# Altium schematic sheet USB.SchDoc
size A
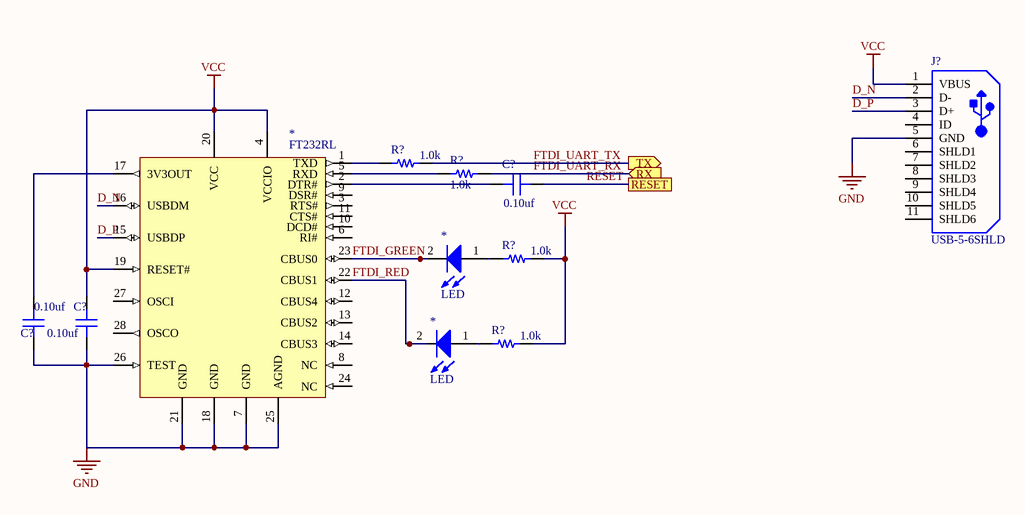
[diagram p0: USB.SchDoc]

## Parts
(Parts that share a designator on the sheet are numbered #1, #2 ... from top to bottom, then left to right.)
*#1  FT232RL  [SSOP-28]
*#2  LED  [0805_LED]
*#3  LED  [0805_LED]
C?#1  value 0.10uf  [CAP 0603/1608]  (hidden comment: Capacitor MLCC 0.10uf 25V CAP 0603/1608)
C?#2  value 0.10uf  [CAP 0603/1608]  (hidden comment: Capacitor MLCC 0.10uf 25V CAP 0603/1608)
C?#3  value 0.10uf  [CAP 0603/1608]  (hidden comment: Capacitor MLCC 0.10uf 25V CAP 0603/1608)
J?  USB-5-6SHLD  [TECO-1981568-5_V]
R?#1  value 1.0k  [RES 0805/2012]  (hidden comment: Resistor 1.0k 0805 1/4W 1%)
R?#2  value 1.0k  [RES 0805/2012]  (hidden comment: Resistor 1.0k 0805 1/4W 1%)
R?#3  value 1.0k  [RES 0805/2012]  (hidden comment: Resistor 1.0k 0805 1/4W 1%)
R?#4  value 1.0k  [RES 0805/2012]  (hidden comment: Resistor 1.0k 0805 1/4W 1%)

## Ports
RESET, RX (in), TX (out)

## Nets
GND: *#1.7(GND) *#1.18(GND) *#1.21(GND) *#1.25(AGND) *#1.26(TEST) C?#2.1 C?#3.1 J?.5(GND)
VCC: *#1.4(VCCIO) *#1.19(RESET#) *#1.20(VCC) C?#3.2 J?.1(VBUS) R?#3.2 R?#4.2
D_N: *#1.16(USBDM) J?.2(D-)
D_P: *#1.15(USBDP) J?.3(D+)
FTDI_GREEN: *#1.23(CBUS0) *#2.2(K)
FTDI_RED: *#1.22(CBUS1) *#3.2(K)
FTDI_UART_RX: R?#2.2 ; port RX
FTDI_UART_TX: R?#1.2 ; port TX
RESET: C?#1.2 ; port RESET
Net*#1_1: *#1.1(TXD) R?#1.1
Net*#1_2: *#1.2(DTR#) C?#1.1
Net*#1_5: *#1.5(RXD) R?#2.1
Net*#1_17: *#1.17(3V3OUT) C?#2.2
Net*#2_1: *#2.1(A) R?#3.1
Net*#3_1: *#3.1(A) R?#4.1

Not connected (* = marked no-connect by the designer): *#1 3(RTS#) 6(RI#) 8(NC) 9(DSR#) 10(DCD#) 11(CTS#) 12(CBUS4) 13(CBUS2) 14(CBUS3) 24(NC) 27(OSCI) 28(OSCO); J? 4(ID) 6(SHLD1) 7(SHLD2) 8(SHLD3) 9(SHLD4) 10(SHLD5) 11(SHLD6)

## Library data of the parts
*#1 = 3: Manufacturer_id: 1; idIC_Interface: 3; Name: USB FTDI; Protocol: UART; Vin(Min): 3.3; Vin(Max): 5.25; Created_By: Kyle; Drawer_id: 1; MfrPartNo: FT232RL; Link: https://www.digikey.com/product-detail/en/ftdi-future-technology-devices-international-ltd/FT232RL-REEL/768-1007-1-ND/1836402
*#2 = 2: Manufacturer_id: 1; idLED: 2; Name: LED_0805_GREEN; Value: Green; Brightness: 35mcd; Id: 20mA; Vf: 2V; Drawer_id: 1
*#3 = 1: idLED: 1; Name: LED_0805_RED; Value: Red; Vf: 0.7V; Manufacturer_id: 1; Drawer_id: 1
C?#1-C?#3 = 583: Manufacturer_id: 1; idCapacitor: 583; Name: Cap_0.10uf_25V_CAP 0603/1608; Dielectric: Ceramic; Created_By: Nick Mah; Drawer_id: 1; Voltage_Rating: 25V; Package: CAP 0603/1608; Created_Date: 10/20/2018
J? = 5: USB Micro Type B; Manufacturer_id: 1; MfrPartNo: 1981568-1; idConn: 5; Name: TE USB Micro; Value: CONN; Created_By: Aiku; Drawer_id: 1; Num_Contacts: 5; Link: https://www.mouser.com/ProductDetail/TE-Connectivity-AMP/1981568-1?qs=sGAEpiMZZMulM8LPOQ%252bykzEIUPbUCiSfqsfxH3Oq%252bYo%3d; ComponentLink1Description: Datasheet; Supplier1: TE; Created_Date: 10/20/2018
R?#1-R?#4 = 721: Manufacturer_id: 1; idResistor: 721; Name: Res_1.0k_0805_1/4W_1%; Created_By: Nick Mah; Supplier 1: Digi-Key; Drawer_id: 1; Tolerance: 1%; Power: 1/4W; Package: 0805; ComponentLink1Description: Datasheet; Created_Date: 2018-10-20